# Altium schematic sheet main_board.SchDoc
size A4
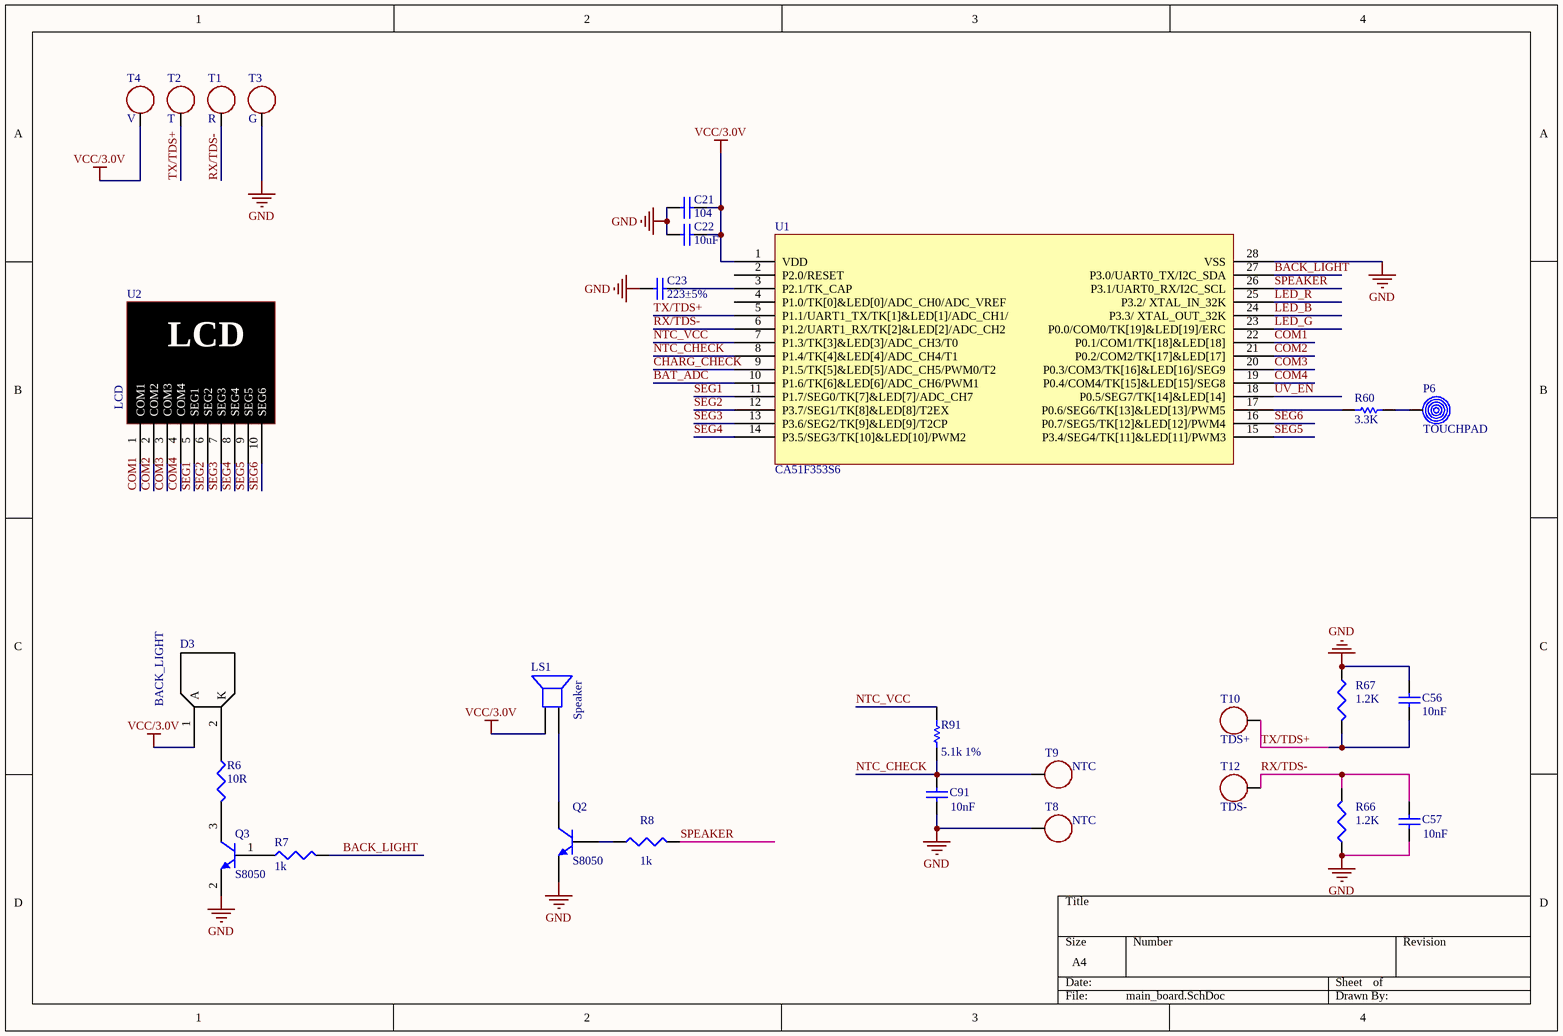
[diagram p0: main_board.SchDoc]

## Parts
C21  value 104  [C0402]  (hidden comment: Cap)
C22  value 10uF  [C0805]  (hidden comment: Cap)
C23  value 223±5%  [C0402]  (hidden comment: Cap)
C56  value 10nF  [C0402]  (hidden comment: Cap)
C57  value 10nF  [C0402]  (hidden comment: Cap)
C91  value 10nF  [C0402]  (hidden comment: Cap)
D3  BACK_LIGHT  [BACK_LIGHT]
LS1  Speaker  [SPEAK]
P6  TOUCHPAD  [TP2MMAAA]
Q2  S8050  [SOT23]
Q3  S8050  [SOT23]
R6  value 10R  [R0402]  (hidden comment: 1.2k)
R7  value 1k  [R0402]  (hidden comment: 1.2k)
R8  value 1k  [R0402]  (hidden comment: 1.2k)
R60  value 3.3K  [R0402]  (hidden comment: Res1)
R66  1.2k  [R0402]
R67  1.2k  [R0402]
R91  value 5.1k 1%  [R0402]  (hidden comment: Res1)
T1  R  [TP1_3MMD]
T2  T  [TP1_3MMD]
T3  G  [TP1_3MMD]
T4  V  [TP1_3MMD]
T8  NTC  [TP1_3MMD]
T9  NTC  [TP1_3MMD]
T10  TDS+  [TP1_3MMD]
T12  TDS-  [TP1_3MMD]
U1  CA51F353S6  [CA51F35S6-SOP28]
U2  LCD  [LCD_DISPLAY]

## Nets
GND: C21.1 C22.1 C23.1 C56.1 C57.1 C91.1 Q2.2(E) Q3.2(E) R66.1 R67.1 T3.1(TOUCHPAD) T8.1(TOUCHPAD) U1.28(VSS)
VCC/3.0V: C21.2 C22.2 D3.1(A) LS1.1 T4.1(TOUCHPAD) U1.1(VDD)
BACK_LIGHT: R7.2 U1.27(P3.0/UART0_TX/I2C_SDA)
BAT_ADC: U1.10(P1.6/TK[6]&LED[6]/ADC_CH6/PWM1)
CHARG_CHECK: U1.9(P1.5/TK[5]&LED[5]/ADC_CH5/PWM0/T2)
COM1: U1.22(P0.1/COM1/TK[18]&LED[18]) U2.1(COM1)
COM2: U1.21(P0.2/COM2/TK[17]&LED[17]) U2.2(COM2)
COM3: U1.20(P0.3/COM3/TK[16]&LED[16]/SEG9) U2.3(COM3)
COM4: U1.19(P0.4/COM4/TK[15]&LED[15]/SEG8) U2.4(COM4)
LED_B: U1.24(P3.3/_XTAL_OUT_32K)
LED_G: U1.23(P0.0/COM0/TK[19]&LED[19]/ERC)
LED_R: U1.25(P3.2/_XTAL_IN_32K)
NTC_CHECK: C91.2 R91.1 T9.1(TOUCHPAD) U1.8(P1.4/TK[4]&LED[4]/ADC_CH4/T1)
NTC_VCC: R91.2 U1.7(P1.3/TK[3]&LED[3]/ADC_CH3/T0)
RX/TDS-: C57.2 R66.2 T1.1(TOUCHPAD) T12.1(TOUCHPAD) U1.6(P1.2/UART1_RX/TK[2]&LED[2]/ADC_CH2)
SEG1: U1.11(P1.7/SEG0/TK[7]&LED[7]/ADC_CH7) U2.5(SEG1)
SEG2: U1.12(P3.7/SEG1/TK[8]&LED[8]/T2EX) U2.6(SEG2)
SEG3: U1.13(P3.6/SEG2/TK[9]&LED[9]/T2CP) U2.7(SEG3)
SEG4: U1.14(P3.5/SEG3/TK[10]&LED[10]/PWM2) U2.8(SEG4)
SEG5: U1.15(P3.4/SEG4/TK[11]&LED[11]/PWM3) U2.9(SEG5)
SEG6: U1.16(P0.7/SEG5/TK[12]&LED[12]/PWM4) U2.10(SEG6)
SPEAKER: R8.2 U1.26(P3.1/UART0_RX/I2C_SCL)
TX/TDS+: C56.2 R67.2 T2.1(TOUCHPAD) T10.1(TOUCHPAD) U1.5(P1.1/UART1_TX/TK[1]&LED[1]/ADC_CH1/)
UV_EN: U1.18(P0.5/SEG7/TK[14]&LED[14])
NetC23_2: C23.2 U1.3(P2.1/TK_CAP)
NetD3_2: D3.2(K) R6.1
NetLS1_2: LS1.2 Q2.3(C)
NetP6_1: P6.1(TOUCHPAD) R60.1
NetQ2_1: Q2.1(B) R8.1
NetQ3_1: Q3.1(B) R7.1
NetQ3_3: Q3.3(C) R6.2
NetR60_2: R60.2 U1.17(P0.6/SEG6/TK[13]&LED[13]/PWM5)

Not connected (* = marked no-connect by the designer): U1 2(P2.0/RESET) 4(P1.0/TK[0]&LED[0]/ADC_CH0/ADC_VREF)

## Library data of the parts
C21-C23 C56 C57 C91 = Cap: 电容; Published: 8-Jun-2000; LatestRevisionDate: 17-Jul-2002; LatestRevisionNote: Re-released for DXP Platform.; PackageReference: RAD-0.3; Publisher: Altium Limited; PackageDescription: Radial Cap, Thru-Hole; 2 Leads; 0.3 in Pin Spacing
D3 = BACK_LIGHT: LCD背光
LS1 = Speaker: 蜂鸣器; Published: 24-Mar-1999; LatestRevisionDate: 17-Jul-2002; LatestRevisionNote: Re-released for DXP Platform.; PackageReference: PIN2; Publisher: Altium Limited
P6 = TOUCHPAD: 触摸弹簧
Q2 Q3 = S8050: 三极管
R6-R8 R66 R67 = Res3: 电阻; Published: 8-Jun-2000; LatestRevisionDate: 29-May-2009; LatestRevisionNote: IPC-7351 Footprint Added.; PackageReference: J1-0603; Publisher: Altium Limited; PackageDescription: Chip Resistor
  R66 R67: Value: 1.2K
R60 R91 = Res1: 电阻; Published: 8-Jun-2000; LatestRevisionDate: 17-Jul-2002; LatestRevisionNote: Re-released for DXP Platform.; PackageReference: AXIAL-0.3; Publisher: Altium Limited; PackageDescription: Axial Device, Thru-Hole; 2 Leads; 0.3 in Pin Spacing
T1 = TEST: 烧录点Rx
T2 = TEST: 烧录点Tx
T3 = TEST: 烧录点GND
T4 = TEST: 烧录点VCC
T8 T9 = TEST: NTC焊点
T10 T12 = TEST: TDS焊点
U1 = CA51F353S6: 主控IC
U2 = LCD: LCD显示屏